# Altium schematic sheet 15-I225-MISC.SchDoc
size A; SheetNumber: 15; SheetTotal: 16
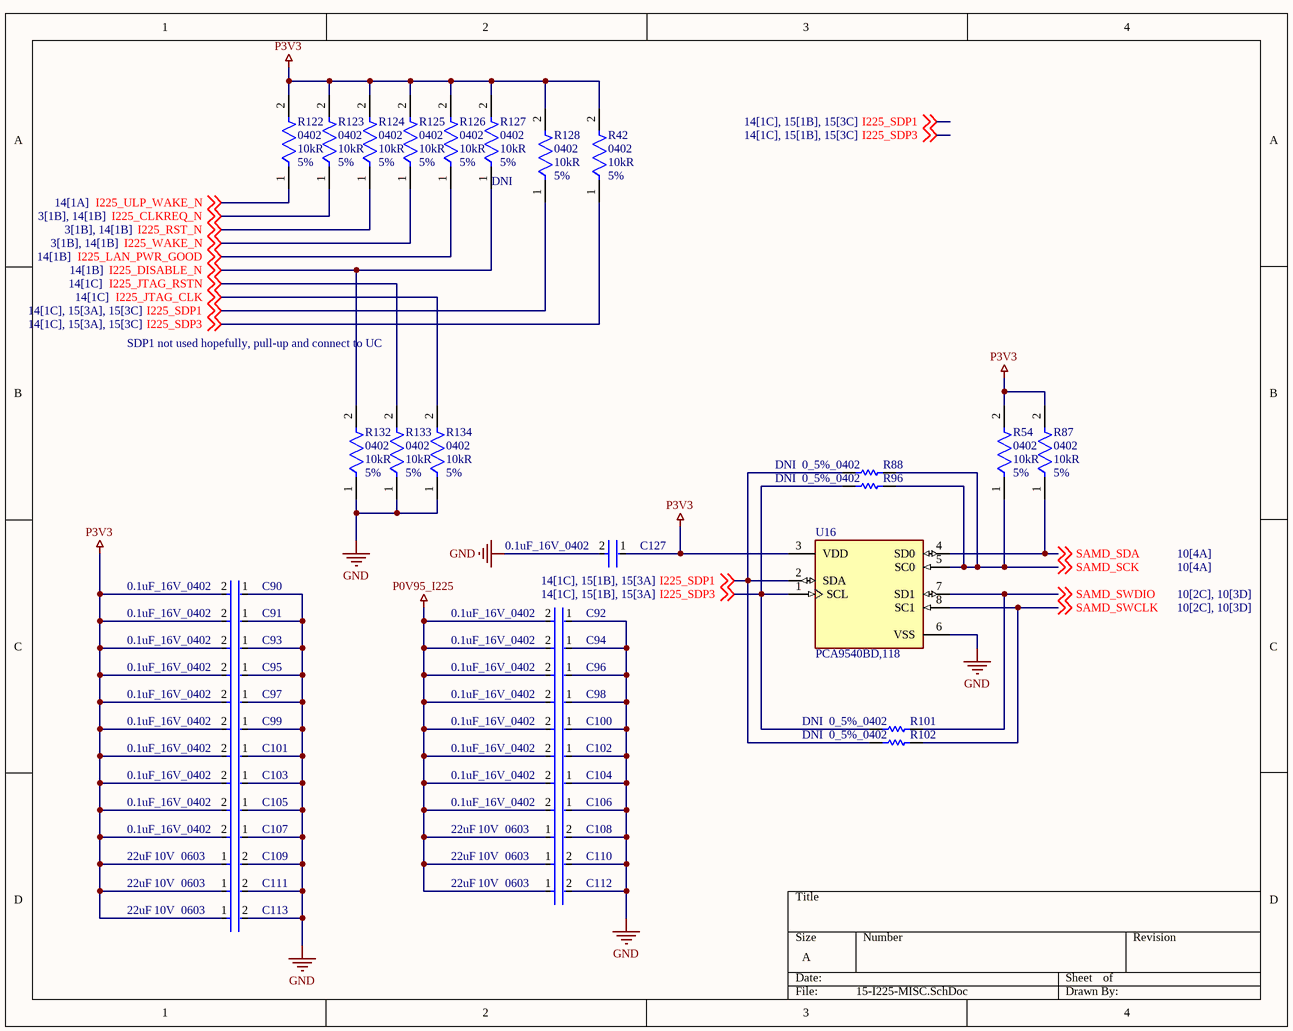
[diagram p0: 15-I225-MISC.SchDoc]

## Parts
C90  0.1uF_16V_0402  [FP-GRM15-MFG]
C91  0.1uF_16V_0402  [FP-GRM15-MFG]
C92  0.1uF_16V_0402  [FP-GRM15-MFG]
C93  0.1uF_16V_0402  [FP-GRM15-MFG]
C94  0.1uF_16V_0402  [FP-GRM15-MFG]
C95  0.1uF_16V_0402  [FP-GRM15-MFG]
C96  0.1uF_16V_0402  [FP-GRM15-MFG]
C97  0.1uF_16V_0402  [FP-GRM15-MFG]
C98  0.1uF_16V_0402  [FP-GRM15-MFG]
C99  0.1uF_16V_0402  [FP-GRM15-MFG]
C100  0.1uF_16V_0402  [FP-GRM15-MFG]
C101  0.1uF_16V_0402  [FP-GRM15-MFG]
C102  0.1uF_16V_0402  [FP-GRM15-MFG]
C103  0.1uF_16V_0402  [FP-GRM15-MFG]
C104  0.1uF_16V_0402  [FP-GRM15-MFG]
C105  0.1uF_16V_0402  [FP-GRM15-MFG]
C106  0.1uF_16V_0402  [FP-GRM15-MFG]
C107  0.1uF_16V_0402  [FP-GRM15-MFG]
C108  Capacitance: 22uF  Voltage Rating: 10V  Case Code (Imperial): 0603  [FP-GRM188-0_2-IPC_C]  (hidden comment: GRM188R61A226ME15D)
C109  Capacitance: 22uF  Voltage Rating: 10V  Case Code (Imperial): 0603  [FP-GRM188-0_2-IPC_C]  (hidden comment: GRM188R61A226ME15D)
C110  Capacitance: 22uF  Voltage Rating: 10V  Case Code (Imperial): 0603  [FP-GRM188-0_2-IPC_C]  (hidden comment: GRM188R61A226ME15D)
C111  Capacitance: 22uF  Voltage Rating: 10V  Case Code (Imperial): 0603  [FP-GRM188-0_2-IPC_C]  (hidden comment: GRM188R61A226ME15D)
C112  Capacitance: 22uF  Voltage Rating: 10V  Case Code (Imperial): 0603  [FP-GRM188-0_2-IPC_C]  (hidden comment: GRM188R61A226ME15D)
C113  Capacitance: 22uF  Voltage Rating: 10V  Case Code (Imperial): 0603  [FP-GRM188-0_2-IPC_C]  (hidden comment: GRM188R61A226ME15D)
C127  0.1uF_16V_0402  [FP-GRM15-MFG]
R42  Case/Package: 0402  Resistance: 10kR  Tolerance: 5%  [FP-CRCW0402-e3-IPC_B]  (hidden comment: CRCW040210K0JNED)
R54  Case/Package: 0402  Resistance: 10kR  Tolerance: 5%  [FP-CRCW0402-e3-IPC_B]  (hidden comment: CRCW040210K0JNED)
R87  Case/Package: 0402  Resistance: 10kR  Tolerance: 5%  [FP-CRCW0402-e3-IPC_B]  (hidden comment: CRCW040210K0JNED)
R88  0_5%_0402  [RESC1005X40X25LL10T10]
R96  0_5%_0402  [RESC1005X40X25LL10T10]
R101  0_5%_0402  [RESC1005X40X25LL10T10]
R102  0_5%_0402  [RESC1005X40X25LL10T10]
R122  Case/Package: 0402  Resistance: 10kR  Tolerance: 5%  [FP-CRCW0402-e3-IPC_B]  (hidden comment: CRCW040210K0JNED)
R123  Case/Package: 0402  Resistance: 10kR  Tolerance: 5%  [FP-CRCW0402-e3-IPC_B]  (hidden comment: CRCW040210K0JNED)
R124  Case/Package: 0402  Resistance: 10kR  Tolerance: 5%  [FP-CRCW0402-e3-IPC_B]  (hidden comment: CRCW040210K0JNED)
R125  Case/Package: 0402  Resistance: 10kR  Tolerance: 5%  [FP-CRCW0402-e3-IPC_B]  (hidden comment: CRCW040210K0JNED)
R126  Case/Package: 0402  Resistance: 10kR  Tolerance: 5%  [FP-CRCW0402-e3-IPC_B]  (hidden comment: CRCW040210K0JNED)
R127  Case/Package: 0402  Resistance: 10kR  Tolerance: 5%  [FP-CRCW0402-e3-IPC_B]  (hidden comment: CRCW040210K0JNED)
R128  Case/Package: 0402  Resistance: 10kR  Tolerance: 5%  [FP-CRCW0402-e3-IPC_B]  (hidden comment: CRCW040210K0JNED)
R132  Case/Package: 0402  Resistance: 10kR  Tolerance: 5%  [FP-CRCW0402-e3-IPC_B]  (hidden comment: CRCW040210K0JNED)
R133  Case/Package: 0402  Resistance: 10kR  Tolerance: 5%  [FP-CRCW0402-e3-IPC_B]  (hidden comment: CRCW040210K0JNED)
R134  Case/Package: 0402  Resistance: 10kR  Tolerance: 5%  [FP-CRCW0402-e3-IPC_B]  (hidden comment: CRCW040210K0JNED)
U16  PCA9540BD,118  [FP-SOT96-1-MFG]

## Nets
GND: C90.1 C91.1 C92.1 C93.1 C94.1 C95.1 C96.1 C97.1 C98.1 C99.1 C100.1 C101.1 C102.1 C103.1 C104.1 C105.1 C106.1 C107.1 C108.2 C109.2 C110.2 C111.2 C112.2 C113.2 C127.2 R132.1 R133.1 R134.1 U16.6(VSS)
P0V95_I225: C92.2 C94.2 C96.2 C98.2 C100.2 C102.2 C104.2 C106.2 C108.1 C110.1 C112.1
P3V3: C90.2 C91.2 C93.2 C95.2 C97.2 C99.2 C101.2 C103.2 C105.2 C107.2 C109.1 C111.1 C113.1 C127.1 R42.2 R54.2 R87.2 R122.2 R123.2 R124.2 R125.2 R126.2 R127.2 R128.2 U16.3(VDD)
I225_CLKREQ_N: R123.1 ; off-sheet I225_CLKREQ_N
I225_DISABLE_N: R127.1 R132.2 ; off-sheet I225_DISABLE_N
I225_JTAG_CLK: R134.2 ; off-sheet I225_JTAG_CLK
I225_JTAG_RSTN: R133.2 ; off-sheet I225_JTAG_RSTN
I225_LAN_PWR_GOOD: R126.1 ; off-sheet I225_LAN_PWR_GOOD
I225_RST_N: R124.1 ; off-sheet I225_RST_N
I225_SDP1: R88.1 R102.1 R128.1 U16.2(SDA) ; off-sheet I225_SDP1
I225_SDP3: R42.1 R96.1 R101.1 U16.1(SCL) ; off-sheet I225_SDP3
I225_ULP_WAKE_N: R122.1 ; off-sheet I225_ULP_WAKE_N
I225_WAKE_N: R125.1 ; off-sheet I225_WAKE_N
SAMD_SCK: R54.1 R88.2 R96.2 U16.5(SC0) ; off-sheet SAMD_SCK
SAMD_SDA: R87.1 U16.4(SD0) ; off-sheet SAMD_SDA
SAMD_SWCLK: R102.2 U16.8(SC1) ; off-sheet SAMD_SWCLK
SAMD_SWDIO: R101.2 U16.7(SD1) ; off-sheet SAMD_SWDIO

## Notes on the sheet
- SDP1 not used hopefully, pull-up and connect to UC

## Library data of the parts
C90-C107 C127 = CMP-2100-03641-2: CAP CER 0.1UF 16V X7R 0402; Manufacturer Part Number: GRM155R71C104KA88D; Manufacturer: Murata; Standoff Height: 0mm; Tolerance: 10%; Voltage Rating: 16Vdc; Material: Ceramic; Capacitance: 0.10μF; Value: 0.10μF; RoHS: TRUE; Temperature Characteristic: X7R; Octopart: https://octopart.com/grm155r71c104ka88d-murata-196880; Digikey Description: CAP CER 0.1UF 16V X7R 0402; Device Class L3: Ceramic Capacitors; Height: 0.55mm; ComponentLink2Description: Datasheet; Temperature Range Low: -55°C; Ipc Land Pattern Name: CAPC10050X219; ComponentLink2URL: https://search.murata.co.jp/Ceramy/image/img/A01X/G101/ENG/GRM155R71H471KA01-01A.pdf; Device Class L1: Passive Components; Lead Free: yes; Category: Cap; Package: GRM15; Temperature: -55°C to +125°C; Device Class L2: Capacitors; Temperature Range High: +125°C; Mouser Description: 0402 0.1 uF 16V ±10 % Tolerance X7R SMT Multilayer Ceramic Capacitor
C108-C113 = CMP-2000-06337-3: Chip Multilayer Ceramic Capacitors for General Purpose, 0603, 22uF, X5R, 15%, 20%, 10V; Tolerance: 20%; Weight: 0.000222oz; Material: Ceramic; Depth: 0.8mm; Length: 1.6mm; Termination: SMD/SMT; Packaging: Tape and Reel; Width: 0.8mm; Mount: Surface Mount; Voltage Rating (DC): 10V; Case/Package: 0603; Thickness: 0.039inch; REACH SVHC: No SVHC; Dielectric: X5R; Height: 0.8mm; Package Quantity: 4000; Case Code (Metric): 1608; Min Operating Temperature: -55°C; Lead Free: Lead Free; Max Operating Temperature: 85°C
R42 R54 R87 R122-R128 R132-R134 = CMP-2002-08136-3: RES Thick Film, 10kΩ, 5%, 0.063W, 200ppm/°C, 0402; Voltage Rating: 50V; Power Rating: 63mW; Military Standard: Not; Packaging: Tape and Reel; Case Code (Imperial): 0402; Min Operating Temperature: -55°C; Case Code (Metric): 1005; Temperature Coefficient: 200ppm/°C; Termination: SMD/SMT; Composition: Thick Film; Depth: 0.5mm; Number of Terminations: 2; Contact Plating: Tin; Height: 0.016inch; Width: 0.5mm; Max Operating Temperature: 155°C; Features: Automotive AEC-Q200; Length: 1mm; Radiation Hardening: No; Max Power Dissipation: 63mW; Mount: Surface Mount; Package Quantity: 1; Weight: 2.3E-05oz
  R127: DNI: DNI
R88 R96 R101 R102 = CMP-2002-04569-1: Manufacturer: KOA Speer; Part Number: RK73Z1ETTP; DNI: DNI
U16 = CMP-10118-000002-1: IC INTERFACE SPECIALIZED 8SO; Logic Function: Multiplexer; Max Frequency: 400kHz; Interface: I2C; Operating Supply Voltage: 5V; Number of Input Lines: 2; Min Supply Voltage: 2.3V; Number of Outputs: 1; On-State Resistance: 55R; Power Dissipation: 400mW; Max Supply Current: 65uA; Low Level Output Current: 6mA; Propagation Delay: 0.3ns; Max Supply Voltage: 5.5V; Number of Pins: 8; Packaging: Tape and Reel; Height: 1.45mm; Contact Plating: Gold; Weight: 0.01787oz; Package Quantity: 1; Number of Output Lines: 1; Lead Free: Lead Free; Radiation Hardening: No; Mount: Surface Mount; Quiescent Current: 65uA; Max Operating Temperature: 85°C; Number of Inputs: 2; Width: 4mm; Case/Package: SO; Min Operating Temperature: -40°C; Length: 5mm